# EAGLE schematic PS_CLK_MAIN (EAGLE 9.0.1)
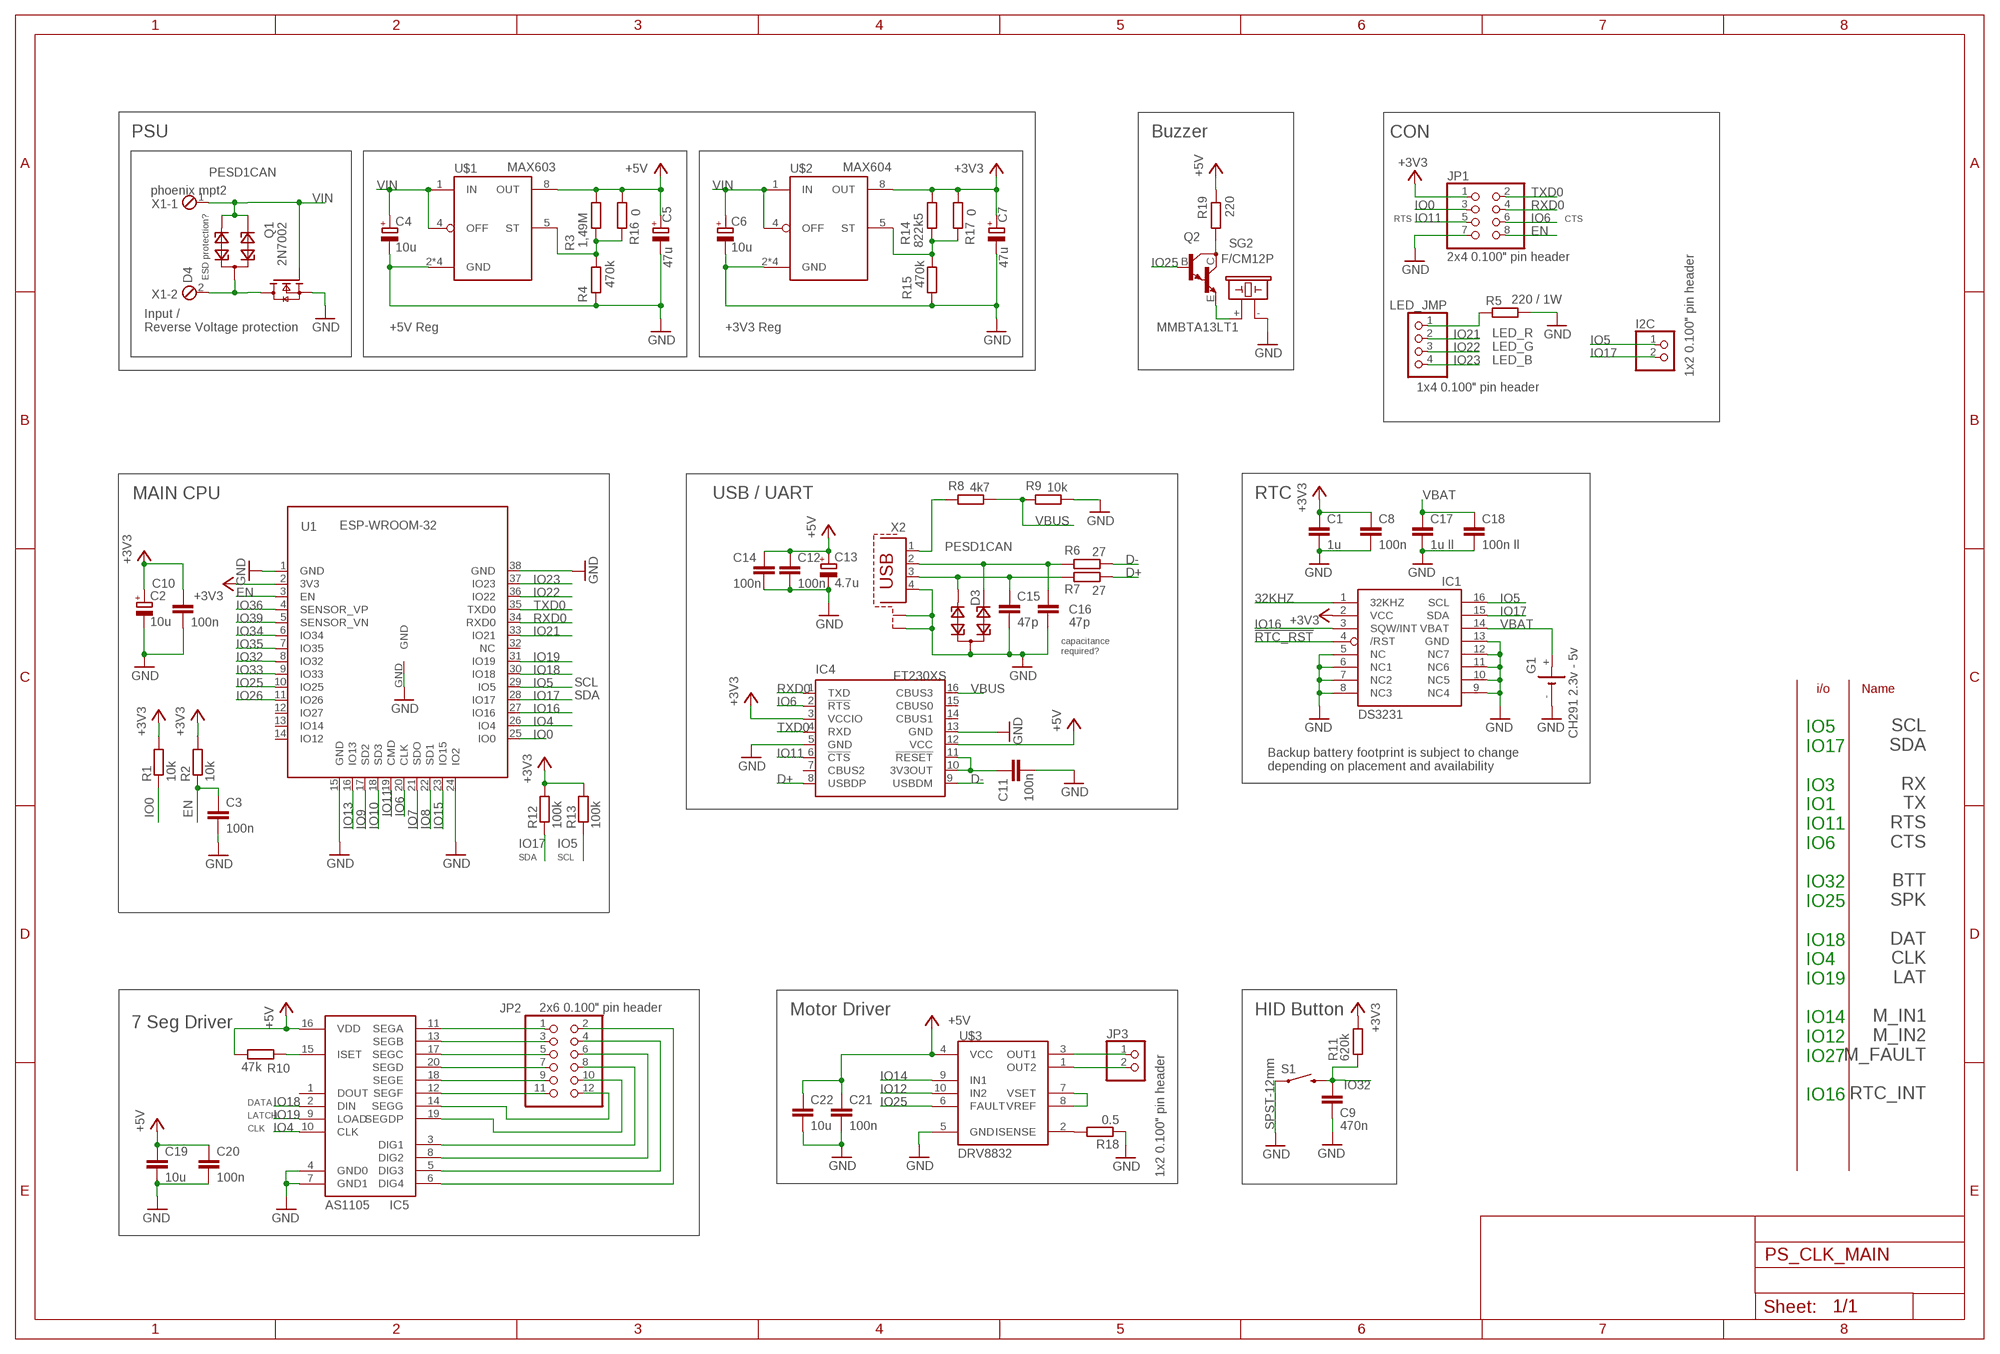
[diagram p0: schematic, sheet 1]

## Parts
C1  1u  C-EUC0805  [C0805]
C2  10u  CPOL-EU153CLV-0505  [153CLV-0505]
C3  100n  C-EUC0805  [C0805]
C4  10u  CPOL-EU153CLV-0505  [153CLV-0505]
C5  47u  CPOL-EU153CLV-0505  [153CLV-0505]
C6  10u  CPOL-EU153CLV-0505  [153CLV-0505]
C7  47u  CPOL-EU153CLV-0505  [153CLV-0505]
C8  100n  C-EUC0805  [C0805]
C9  470n  C-EUC0805  [C0805]
C10  100n  C-EUC0805  [C0805]
C11  100n  C-EUC0805  [C0805]
C12  100n  C-EUC0805  [C0805]
C13  4.7u  CPOL-EU153CLV-0505  [153CLV-0505]
C14  100n  C-EUC0805  [C0805]
C15  47p  C-EUC0805  [C0805]
C16  47p  C-EUC0805  [C0805]
C17  1u ll  C-EUC0805  [C0805]
C18  100n ll  C-EUC0805  [C0805]
C19  10u  C-EUC0805  [C0805]
C20  100n  C-EUC0805  [C0805]
C21  100n  C-EUC0805  [C0805]
C22  10u  C-EUC0805  [C0805]
D3  PESD1CAN  [SOT23]
D4  PESD1CAN  [SOT23]
G1  CH291 2.3v - 5v  CH291-1220LF  [CH291-1220LF]
I2C  1x2 0.100" pin header  PINHD-1X2_2.54  [1X02]
IC1  DS3231/SO  [SO16W]
IC4  FT230XS  [SSOP16]
IC5  AS1105  [SOIC20R]
JP1  2x4 0.100" pin header  PINHD-2X4_2.00  [2X04M]
JP2  2x6 0.100" pin header  PINHD-2X6_2.00  [2X06M]
JP3  1x2 0.100" pin header  PINHD-1X2_2.54  [1X02]
LED_JMP  1x4 0.100" pin header  PINHD-1X4_2.00  [1X04M]
Q1  2N7002  2N7002E  [SOT23]
Q2  MMBTA13LT1  [SOT23-BEC]
R1  10k  R-EU_R0603  [R0603]
R2  10k  R-EU_R0603  [R0603]
R3  1,49M  R-EU_M0805  [M0805]
R4  470k  R-EU_M0805  [M0805]
R5  220 / 1W  R-EU_R2512  [R2512]
R6  27  R-EU_M0805  [M0805]
R7  27  R-EU_M0805  [M0805]
R8  4k7  R-EU_M0805  [M0805]
R9  10k  R-EU_M0805  [M0805]
R10  47k  R-EU_M0805  [M0805]
R11  620k  R-EU_M0805  [M0805]
R12  100k  R-EU_M0805  [M0805]
R13  100k  R-EU_M0805  [M0805]
R14  822k5  R-EU_M0805  [M0805]
R15  470k  R-EU_M0805  [M0805]
R16  0  R-EU_M0805  [M0805]
R17  0  R-EU_M0805  [M0805]
R18  0.5  R-EU_R2010  [R2010]
R19  220  R-EU_M0805  [M0805]
S1  SPST-12mm  MOMENTARY-SWITCH-SPST-SMD-12MM  [TACTILE_SWITCH_SMD_12MM]
SG2  F/CM12P  [F/CM12P]
U1  ESP-WROOM-32  [ESP-WROOM-32]
U$1  MAX603  MAX604  [SOIC8]
U$2  MAX604  [SOIC8]
U$3  DRV8832  [MSOP10]
X1  phoenix mpt2  MPT2  [2POL254]
X2  PN61729-S  [PN61729-S]

## Nets
32KHZ: IC1.1(32KHZ)
!RTC_RST: IC1.4(/RST)
+3V3: C1.1 C2.+ C7.+ C8.1 C10.1 IC1.2(VCC) IC4.3(VCCIO) JP1.1 R1.2 R2.2 R11.2 R12.2 R13.2 R14.1 R17.1 U1.2(3V3) U$2.8(OUT)
+5V: C5.+ C12.1 C13.+ C14.1 C19.1 C20.1 C21.1 C22.1 IC4.12(VCC) IC5.16(VDD) R3.1 R10.1 R16.1 R19.1 U$1.8(OUT) U$3.4(VCC)
D+: IC4.8(USBDP) R7.1
D-: IC4.9(USBDM) R6.1
EN: C3.1 JP1.8 R2.1 U1.3(EN)
GND [gnd]: C1.2 C2.- C3.2 C4.- C5.- C6.- C7.- C8.2 C9.2 C10.2 C11.2 C12.2 C13.- C14.2 C15.2 C16.2 C17.2 C18.2 C19.2 C20.2 C21.2 C22.2 D3.3 G1.- IC1.5(NC) IC1.6(NC1) IC1.7(NC2) IC1.8(NC3) IC1.9(NC4) IC1.10(NC5) IC1.11(NC6) IC1.12(NC7) IC1.13(GND) IC4.5(GND) IC4.13(GND) IC5.4(GND0) IC5.7(GND1) JP1.7 Q1.2(S) R4.2 R5.2 R9.1 R15.2 R18.1 S1.1 SG2.- U1.1(GND) U1.15(GND) U1.24(IO2) U1.38(GND) U1.GND U$1.2(GND) U$1.3(GND) U$1.6(GND) U$1.7(GND) U$2.2(GND) U$2.3(GND) U$2.6(GND) U$2.7(GND) U$3.5(GND) X2.4 X2.S1 X2.S2
IO0: JP1.3 R1.1 U1.25(IO0)
IO4: IC5.10(CLK) U1.26(IO4)
IO5: I2C.1 IC1.16(SCL) R13.1 U1.29(IO5)
IO6: IC4.2(!RTS) JP1.6 U1.20(CLK)
IO7: U1.21(SDO)
IO8: U1.22(SD1)
IO9: U1.17(SD2)
IO10: U1.18(SD3)
IO11: IC4.6(!CTS) JP1.5 U1.19(CMD)
IO12: U$3.10(IN2)
IO13: U1.16(IO13)
IO14: U$3.9(IN1)
IO15: U1.23(IO15)
IO16: IC1.3(SQW/INT) U1.27(IO16)
IO17: I2C.2 IC1.15(SDA) R12.1 U1.28(IO17)
IO18: IC5.2(DIN) U1.30(IO18)
IO19: IC5.9(LOAD) U1.31(IO19)
IO21: LED_JMP.2 U1.33(IO21)
IO22: LED_JMP.3 U1.36(IO22)
IO23: LED_JMP.4 U1.37(IO23)
IO25: Q2.B U1.10(IO25) U$3.6(FAULT)
IO26: U1.11(IO26)
IO32: C9.1 R11.1 S1.3 U1.8(IO32)
IO33: U1.9(IO33)
IO34: U1.6(IO34)
IO35: U1.7(IO35)
IO36: U1.4(SENSOR_VP)
IO39: U1.5(SENSOR_VN)
N$1: LED_JMP.1 R5.1
N$2: R3.2 R4.1 R16.2 U$1.5(ST)
N$3: R8.2 X2.1
N$4: R14.2 R15.1 R17.2 U$2.5(ST)
N$5: IC5.11(SEGA) JP2.1
N$6: D4.3 Q1.3(D) X1.2
N$7: C11.1 IC4.10(3V3OUT) IC4.11(!RESET)
N$8: C15.1 D3.2 R7.2 X2.3
N$9: C16.1 D3.1 R6.2 X2.2
N$10: IC5.13(SEGB) JP2.3
N$11: IC5.17(SEGC) JP2.5
N$12: IC5.20(SEGD) JP2.7
N$13: IC5.18(SEGE) JP2.9
N$14: IC5.12(SEGF) JP2.11
N$15: IC5.14(SEGG) JP2.12
N$16: IC5.19(SEGDP) JP2.10
N$17: IC5.3(DIG1) JP2.8
N$18: IC5.8(DIG2) JP2.6
N$19: IC5.5(DIG3) JP2.4
N$20: IC5.6(DIG4) JP2.2
N$21: IC5.15(ISET) R10.2
N$22: R18.2 U$3.2(ISENSE)
N$23: U$3.7(VSET) U$3.8(VREF)
N$24: JP3.2 U$3.1(OUT2)
N$25: JP3.1 U$3.3(OUT1)
N$26: Q2.E SG2.+
N$28: Q2.C R19.2
RXD0: IC4.1(TXD) JP1.4 U1.34(RXD0)
TXD0: IC4.4(RXD) JP1.2 U1.35(TXD0)
VBAT: C17.1 C18.1 G1.+ IC1.14(VBAT)
VBUS: IC4.16(CBUS3) R8.1 R9.2
VIN: C4.+ C6.+ D4.1 D4.2 Q1.1(G) U$1.1(IN) U$1.4(OFF) U$2.1(IN) U$2.4(OFF) X1.1
Unconnected: IC4.7(CBUS2) IC4.14(CBUS1) IC4.15(CBUS0) IC5.1(DOUT) U1.12(IO27) U1.13(IO14) U1.14(IO12) U1.32(NC)

## Notes on the sheet
- PSU | Buzzer | CON
- RTS | CTS
- ESD protection?
- Input / 
  Reverse Voltage protection
- +5V Reg | +3V3 Reg
- LED_R
  LED_G
  LED_B
- MAIN CPU | USB / UART | RTC
- capacitance
  required?
- SCL
- i/o | Name
- SDA
- Backup battery footprint is subject to change
  depending on placement and availability
- SDA | SCL
- Motor Driver | HID Button
- 7 Seg Driver
- IO5
  IO17
  
  IO3
  IO1
  IO11
  IO6
  
  IO32
  IO25
  
  IO18
  IO4
  IO19
  
  IO14
  IO12
  IO27
  
  IO16
- DATA
- LATCH
- SCL
  SDA
  
  RX
  TX
  RTS
  CTS
  
  BTT
  SPK
  
  DAT
  CLK
  LAT
  
  M_IN1
  M_IN2
  M_FAULT
  
  RTC_INT
- CLK

## Library data of the parts
C1 C3 C8-C12 C14-C22 = resistor:C-EU: CAPACITOR, European symbol
C2 C4-C7 C13 = resistor:CPOL-EU: POLARIZED CAPACITOR, European symbol
D3 D4 = diode:PESD1CAN: CAN bus ESD protection diode Source: http://www.nxp.com/documents/data_sheet/PESD1CAN.pdf
G1 = battery:CH291-1220LF: Battery Holder, SMT, 12mm multicomp PART NO. CH291-1220LF Source: Data sheet <http://www.farnell.com/datasheets/1505860.pdf>
I2C JP3 = con-pinhead:PINHD-1X2: PIN HEADER
IC1 = adafruit:DS3231
IC4 = ftdichip:FT230X: USB to BASIC UART IC Auto generated by make-symbol-device-package-bsdl.ulp Rev. 43 Source: Data sheet <http://www.ftdichip.com/Support/Documents/DataSheets/ICs/DS_FT230X.pdf>
IC5 = AS1105:AS1105: literally just the 7-segment led driver as1105
JP1 = con-pinhead:PINHD-2X4: PIN HEADER
JP2 = con-pinhead:PINHD-2X6: PIN HEADER
LED_JMP = con-pinhead:PINHD-1X4: PIN HEADER
Q1 = nxp_60_1_1:2N7002: N-channel TrenchMOS FET N-channel enhancement mode Field-Effect Transistor (FET) in a plastic package using TrenchMOS technology. AAL Eindhoven MK
Q2 = transistor-npn:MMBTA13*: NPN Darlington Transistor
R1 R2 = rcl:R-EU_: RESISTOR, European symbol
R3-R19 = resistor:R-EU_: RESISTOR, European symbol
S1 = SparkFun-Switches:MOMENTARY-SWITCH-SPST: Momentary Switch (Pushbutton) - SPST Normally-open (NO) SPST momentary switches (buttons, pushbuttons). Variants PTH-12MM - 12mm square, through-hole Momentary Pushbutton Switch - 12mm Square <https://www.sparkfun.com/products/9190> (COM-09190) PTH-6.0MM, PTH-6.0MM-KIT - 6.0mm square, through-hole Mini Pushbutton Switch <https://www.sparkfun.com/products/97> (COM-00097) KIT package intended for soldering kit's - only one side of pads' copper is exposed. PTH-RIGHT-ANGLE-KIT - Right-angle, through-hole Right Angle Tactile Button <https://www.sparkfun.com/products/10791> - Used on SparkFun BigTime Watch Kit <https://www.sparkfun.com/products/11734> SMD-12MM - 12mm square, surface-mount Tactile Button - SMD (12mm) <https://www.sparkfun.com/products/12993> (COM-12993) Used on SparkFun PicoBoard <https://www.sparkfun.com/products/11888> SMD-4.5MM - 4.5mm Square Trackball Switch Used on SparkFun Blackberry Trackballer Breakout <https://www.sparkfun.com/products/13169> SMD-4.6MMX2.8MM - 4.60mm x 2.80mm, surface mount Used on SparkFun SAMD21 Mini Breakout <https://www.sparkfun.com/products/13664> SMD-5.2MM, SMD-5.2-REDUNDANT - 5.2mm square, surface-mount Mini Pushbutton Switch - SMD <https://www.sparkfun.com/products/8720> (COM-08720) Used on Arduino Pro Mini <https://www.sparkfun.com/products/11114> REDUNDANT package connects both switch circuits together SMD-6.0X3.5MM - 6.0 x 3.5mm, surface mount Momentary Reset Switch SMD <https://www.sparkfun.com/products/8229> (COM-08229) SMD-6.2MM-TALL - 6.2mm square, surface mount Tactile Button - SMD (6mm) <https://www.sparkfun.com/products/12992> Used on SparkFun Digital Sandbox <https://www.sparkfun.com/products/12651> SMD-RIGHT-ANGLE - Right-angle, surface mount Used on SparkFun Block for Intel® Edison - Arduino <https://www.sparkfun.com/products/13036>; PROD_ID: SWCH-11967; SF_SKU: COM-12993
SG2 = buzzer:F/CM12P: BUZZER Source: Buerklin; OC_FARNELL: unknown; OC_NEWARK: unknown
U1 = esp32:ESP-WROOM-32
U$1 U$2 = CLK_IC:MAX604
U$3 = CLK_IC:DRV8832
X1 = con-phoenix-254:MPT2: PHOENIX CONNECTOR; OC_FARNELL: unknown; OC_NEWARK: unknown
X2 = con-berg:PN61729-S: BERG USB connector; OC_FARNELL: unknown; OC_NEWARK: unknown

## Net classes
1 gnd: width 0.635 mm, drill 0.635 mm, clearance 0.254 mm
2 vcc: width 0.406 mm, drill 0.406 mm, clearance 0.254 mm